# EasyEDA Pro project 10A_PWM_555.eprj

# Schematic 10A pwm jasmin
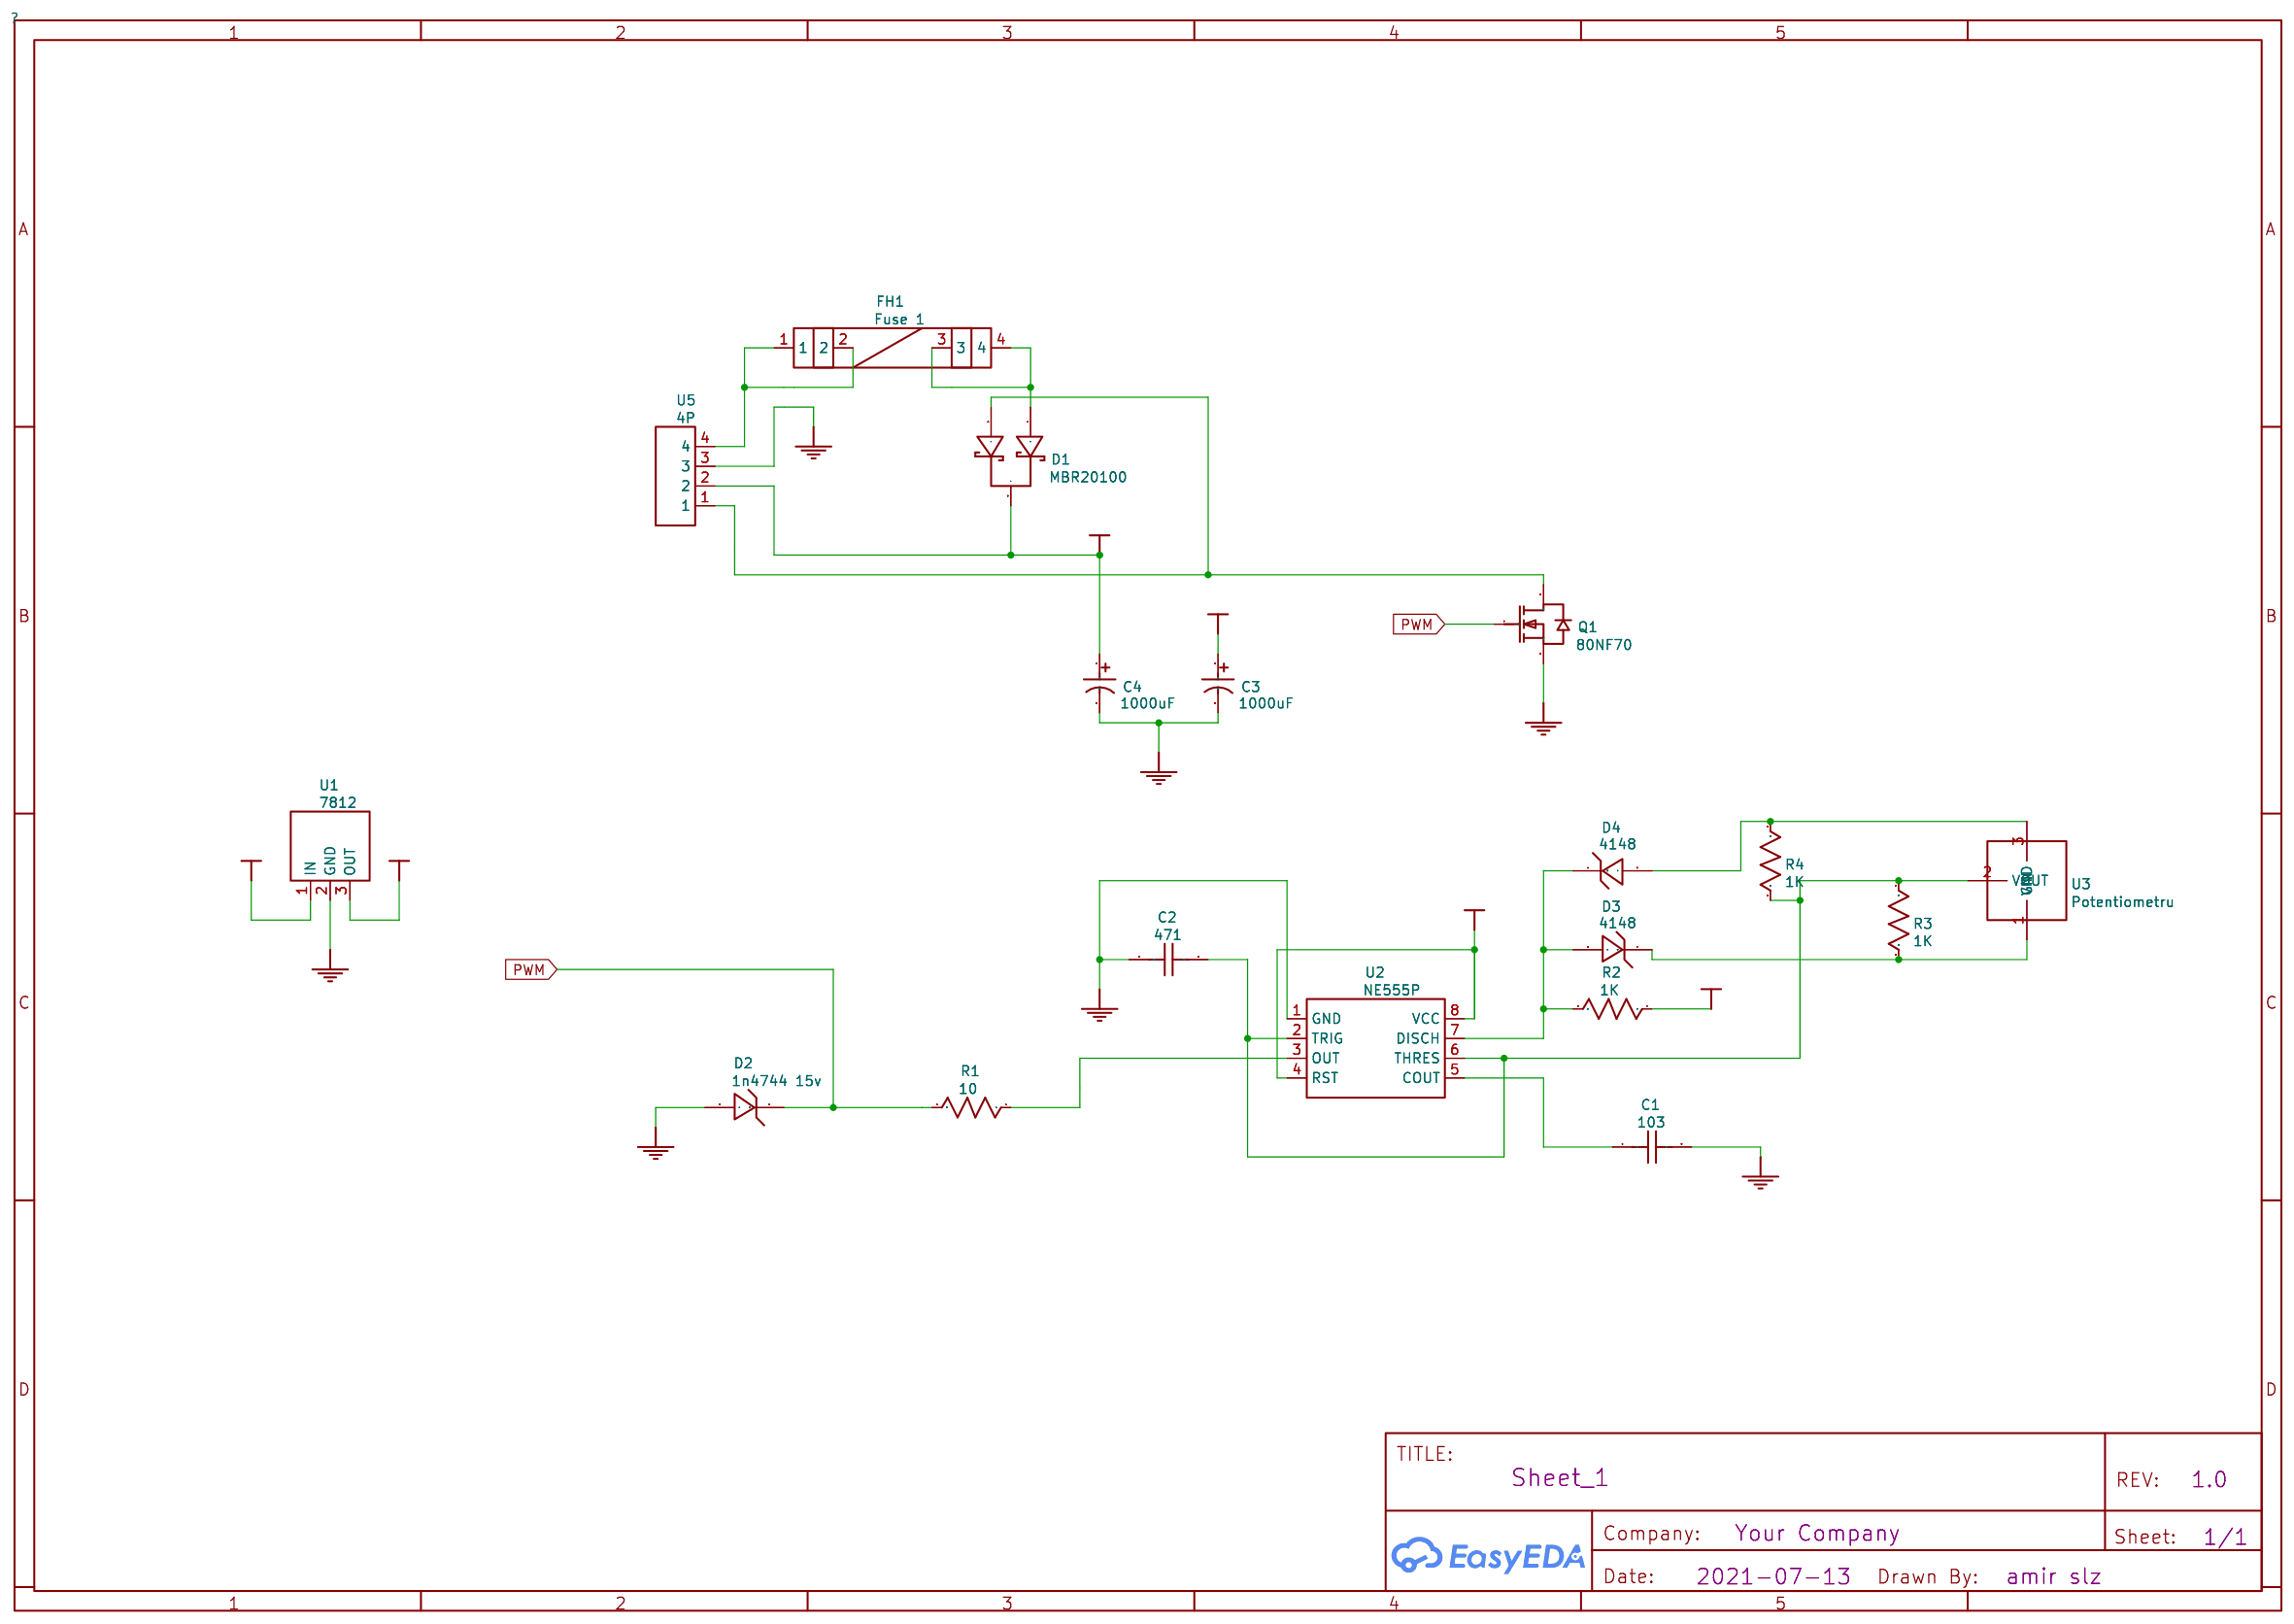
[diagram p0: schematic sheet]

## Parts
C1  103
C2  471
C3  1000uF  [CAP-TH_BD12.5-P5.00-D0.6-FD]
C4  1000uF  [CAP-TH_BD12.5-P5.00-D0.6-FD]
D1  MBR20100  [TO-220AB-3_L10.4-W4.6-P2.54-L]
D2  1n4744 15v  [DO-41_BD2.4-L4.7-P8.70-D0.9-RD]
D3  4148  [DO-41_BD2.4-L4.7-P8.70-D0.9-RD]
D4  4148  [DO-41_BD2.4-L4.7-P8.70-D0.9-RD]
FH1  Fuse 1
Q1  80NF70  [TO-220AB-3_L10.4-W4.6-P2.54-L]
R1  10
R2  1K
R3  1K
R4  1K
U1  7812  [TO-220-3_L10.0-W4.5-P2.54-L]
U2  NE555P  [DIP-8_L9.8-W6.6-P2.54-LS7.6-BL]
U3  Potentiometru
U5  4P

## Library data of the parts
C1 = 103: Supplier: LCSC; Supplier Part: C913493; Manufacturer: muRata(村田); Manufacturer Part: RDE5C1H100J0M1H03A; JLCPCB Part Class: Extended Part; Contributor: LCSC; spicePre: C; spiceSymbolName: RDE5C1H100J0M1H03A
C2 = 471: Supplier: LCSC; Supplier Part: C913493; Manufacturer: muRata(村田); Manufacturer Part: RDE5C1H100J0M1H03A; JLCPCB Part Class: Extended Part; Contributor: LCSC; spicePre: C; spiceSymbolName: RDE5C1H100J0M1H03A
C3 C4 = 1000uF: Supplier: LCSC; Manufacturer: ValuePro; Manufacturer Part: 1000uF 50V; Supplier Part: C18104; JLCPCB Part Class: Extended Part; nameAlias: Capacitance; spicePre: C; spiceSymbolName: 1000uF 50V
D1 = MBR20100: Supplier: LCSC; Supplier Part: C432693; Manufacturer: Chongqing Pingwei Tech; Manufacturer Part: MBR20150LCT; JLCPCB Part Class: Extended Part; Contributor: LCSC; spicePre: D; spiceSymbolName: MBR20150LCT
D2 = 1n4744 15v: Supplier: LCSC; Supplier Part: C232465; Manufacturer: ON Semicon; Manufacturer Part: 1N5919BRLG; JLCPCB Part Class: Extended Part; Contributor: LCSC; spicePre: D; spiceSymbolName: 1N5919BRLG
D3 D4 = 4148: Supplier: LCSC; Supplier Part: C232465; Manufacturer: ON Semicon; Manufacturer Part: 1N5919BRLG; JLCPCB Part Class: Extended Part; Contributor: LCSC; spicePre: D; spiceSymbolName: 1N5919BRLG
FH1 = Fuse 1: Supplier Part: C377342; Manufacturer: HOLLY(好利来); Manufacturer Part: HF-004/J; JLCPCB Part Class: Extended Part; Contributor: amir slz; spicePre: F
Q1 = 80NF70: Supplier: LCSC; Supplier Part: C469330; Manufacturer: VISHAY(威世); Manufacturer Part: IRF540PBF; JLCPCB Part Class: Extended Part; Contributor: LCSC; spicePre: Q; spiceSymbolName: IRF540PBF
R1 = 10: Manufacturer Part: 0.4W 1% RESISTOR; Contributor: dannyjacket; spicePre: U; spiceSymbolName: RESISTOR
R2-R4 = 1K: Manufacturer Part: 0.4W 1% RESISTOR; Contributor: dannyjacket; spicePre: U; spiceSymbolName: RESISTOR
U1 = 7812: Supplier: LCSC; Supplier Part: C358369; Manufacturer: Foshan Blue Rocket Elec; JLCPCB Part Class: Extended Part; Contributor: LCSC; spicePre: U
U2 = NE555P: Supplier: LCSC; Manufacturer: TI; Supplier Part: C46749; JLCPCB Part Class: Extended Part; spicePre: U
U3 = Potentiometru: Contributor: DMCalin; spicePre: U
U5 = 4P: Supplier: LCSC; Supplier Part: C729813; Manufacturer: DIBO; Manufacturer Part: DBT50B-9.5-4P; JLCPCB Part Class: Extended Part; Contributor: LCSC; spicePre: U; spiceSymbolName: DBT50B-9.5-4P

## Nets
+12V: C3.1 R2.1 U1.3(OUT) U2.4(RST) U2.8(VCC)
GND: C1.2 C2.1 C3.2 C4.2 D2.2(A) Q1.3(S) U1.2(GND) U2.1(GND) U5.3
VCC: C4.1 D1.2(-) U1.1(IN) U5.2
PWM: D2.1(C) Q1.1(G) R1.2
D1_1: D1.1(+) FH1.3 FH1.4
D1_3: D1.3(+) Q1.2(D) U5.1
D3_1: D3.1(C) R3.2 U3.1(VIN)
D4_2: D4.2(A) R4.2 U3.3(GND)
U2_2: C2.2 R3.1 R4.1 U2.2(TRIG) U2.6(THRES) U3.2(VOUT)
U2_3: R1.1 U2.3(OUT)
U2_5: C1.1 U2.5(COUT)
U2_7: D3.2(A) D4.1(C) R2.2 U2.7(DISCH)
U5_4: FH1.1 FH1.2 U5.4

# Board PCB_10A-pwm-DIP_2026-05-13
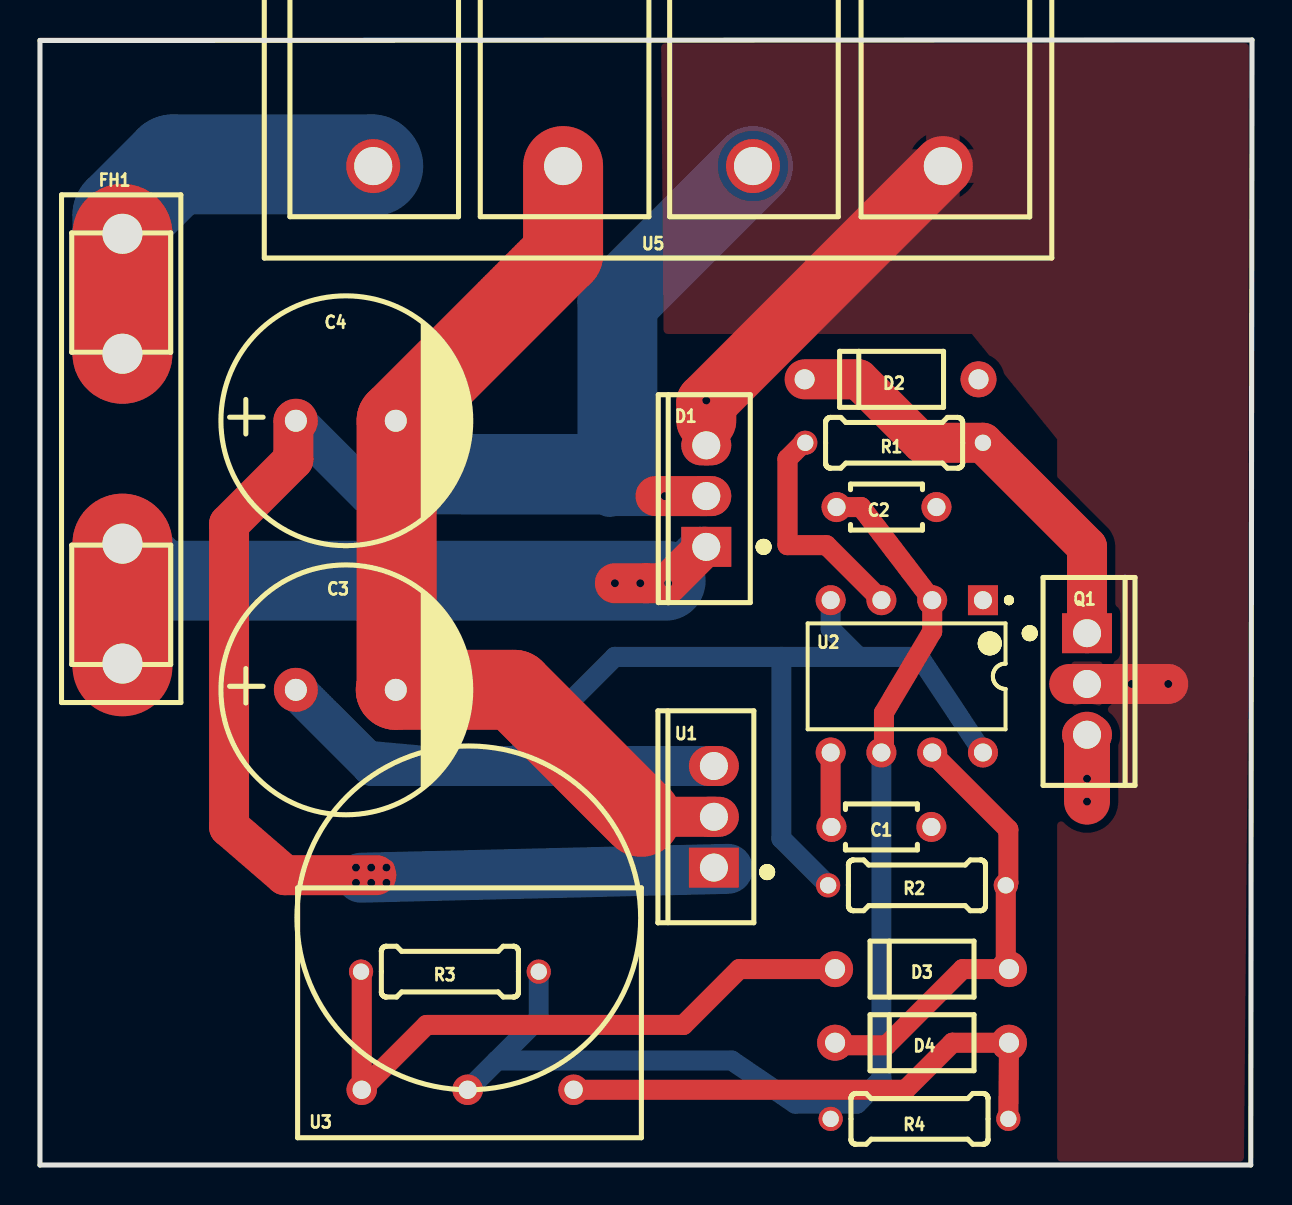
[diagram p1: board, top side]
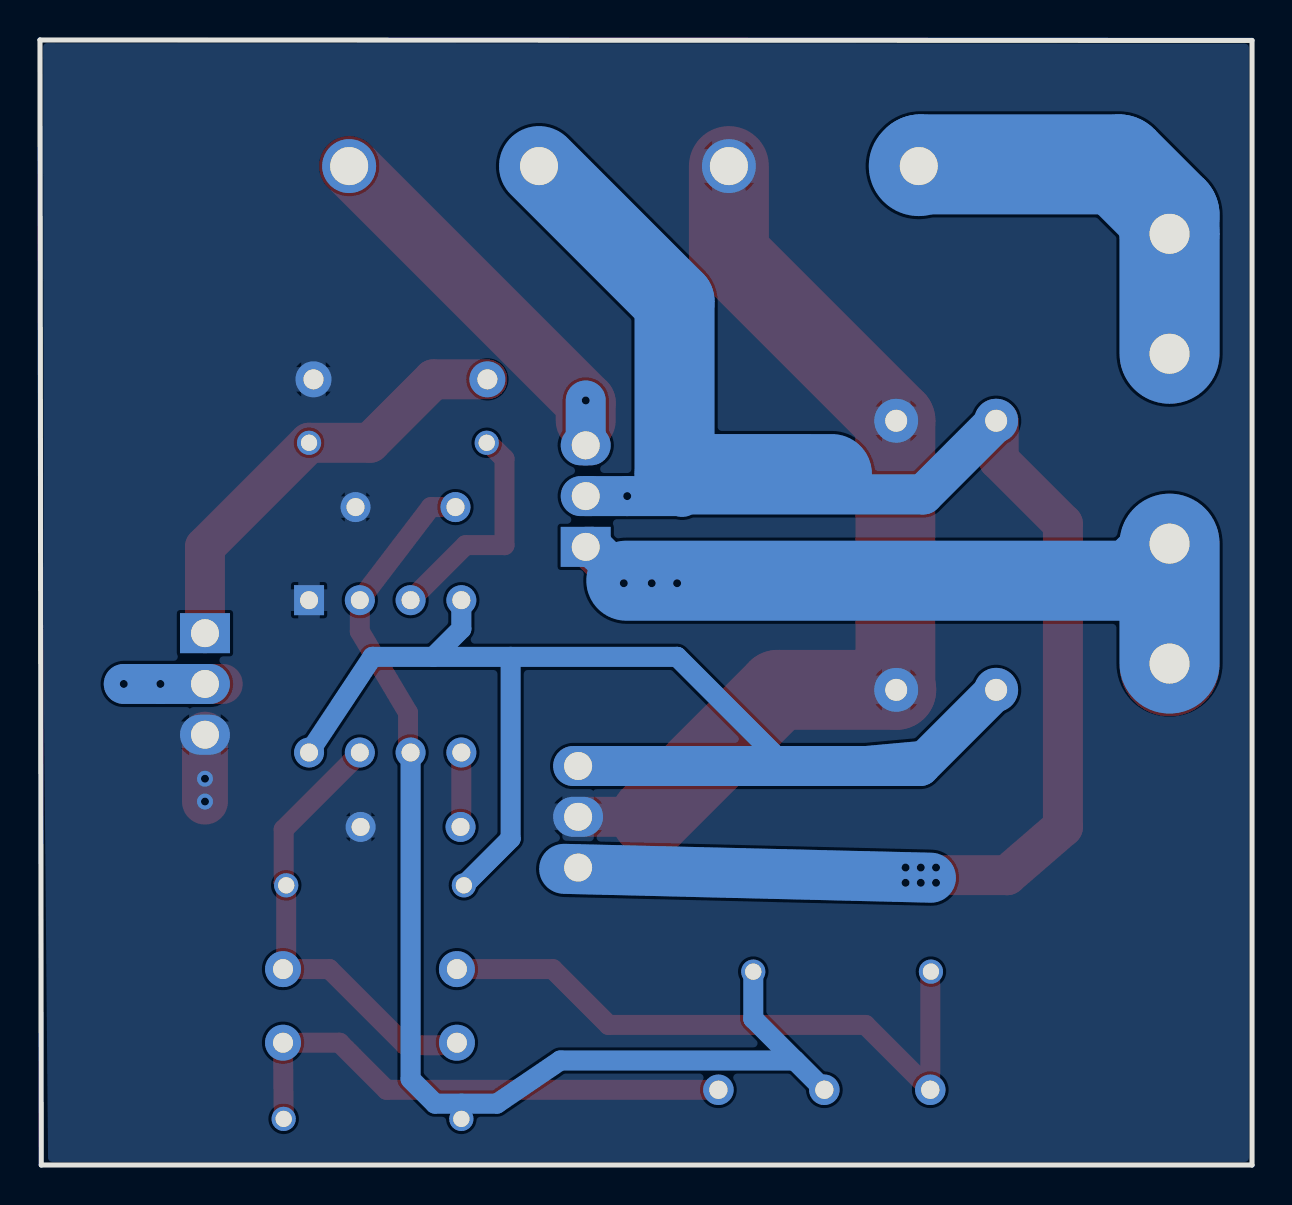
[diagram p2: board, bottom side, seen from below]

Outline 60.64 x 56.28 mm; copper layers: Top Layer, Bottom Layer. Coordinates in mm from the lower left corner of the outline.
Outline path: 0,56.26 60.64,56.28 60.58,0 0,0 0,56.26
Stack: Top Layer 0.035mm / Dielectric1 1.51mm FR4 er 4.5 / Bottom Layer 0.035mm

## Design rules (mm)
spacing Default (default): track to track 0.152, other pairs 0 to 0.152
track width Default (default): min 0.254, default 0.254, max 25.4
differential pair differentialPair (default): width min 0.127, default 0.254, max 2.54; gap min 0.152, default 0.152
via Default (default): diameter min 0.61, default 0.61, max 100.025; hole min 0.305, default 0.305, max 59.995
pour e67 uses gge2414
pour e113 uses gge2398

## Placement (name value [footprint] x y rotation side)
C1  103  [CAP-TH_L3.6-W2.3-P5.00-D0.5]  42.1 16.91 0 top
C2  471  [CAP-TH_L3.6-W2.3-P5.00-D0.5]  42.35 32.92 180 top
C3  1000uF  [CAP-TH_BD12.5-P5.00-D0.6-FD]  15.3 23.77 0 top
C4  1000uF  [CAP-TH_BD12.5-P5.00-D0.6-FD]  15.3 37.23 0 top
D1  MBR20100  [TO-220AB-3_L10.4-W4.6-P2.54-L]  33.34 33.46 90 top
D2  1n4744 15v  [DO-41_BD2.4-L4.7-P8.70-D0.9-RD]  42.61 39.31 0 top
D3  4148  [DO-41_BD2.4-L4.7-P8.70-D0.9-RD]  44.13 9.8 0 top
D4  4148  [DO-41_BD2.4-L4.7-P8.70-D0.9-RD]  44.13 6.12 0 top
FH1  Fuse 1  [FUSE]  4.13 35.84 270 top
Q1  80NF70  [TO-220AB-3_L10.4-W4.6-P2.54-L]  52.39 24.07 270 top
R1  10  [0.4W 1% RESISTOR]  47.18 36.13 180 top
R2  1K  [0.4W 1% RESISTOR]  48.32 13.99 180 top
R3  1K  [0.4W 1% RESISTOR]  16.07 9.67 0 top
R4  1K  [0.4W 1% RESISTOR]  48.45 2.31 180 top
U1  7812  [TO-220-3_L10.0-W4.5-P2.54-L]  33.72 17.42 90 top
U2  NE555P  [DIP-8_L9.8-W6.6-P2.54-LS7.6-BL]  43.37 24.45 180 top
U3  Potentiometru  [POTENTIOMETRU]  21.4 5.86 90 top
U5  4P  [CONN-TH_DBT50B-9.5-4P]  30.92 49.97 180 top

## Footprints (pads in the part's own frame, mm; a bottom-side part is the same pattern mirrored in y, then rotated)
0.4W 1% RESISTOR
  round 1.212 hole 0.813: 1(8.89,0) 2(0,0)
CAP-TH_BD12.5-P5.00-D0.6-FD
  round 2.2 hole 1.1: 1(-2.5,0) 2(2.5,0)
CAP-TH_L3.6-W2.3-P5.00-D0.5
  round 1.5 hole 0.9: 1(-2.5,0) 2(2.5,0)
CONN-TH_DBT50B-9.5-4P
  round 2.7 hole 1.9: 1(-14.25,0) 2(-4.75,0) 3(4.75,0) 4(14.25,0)
DIP-8_L9.8-W6.6-P2.54-LS7.6-BL
  rect 1.5x1.5 hole 0.9: 1(-3.81,-3.81)
  round 1.5 hole 0.9: 2(-1.27,-3.81) 3(1.27,-3.81) 4(3.81,-3.81) 5(3.81,3.81) 6(1.27,3.81) 7(-1.27,3.81) 8(-3.81,3.81)
DO-41_BD2.4-L4.7-P8.70-D0.9-RD
  round 1.8 hole 1: 1(-4.35,0) 2(4.35,0)
FUSE
  round 3 hole 2: 1(-10.75,0) 2(-4.75,0) 3(4.75,0) 4(10.75,0)
POTENTIOMETRU
  round 1.524 hole 0.914: 1(-2.1,5.3) 2(-2.1,0) 3(-2.1,-5.3)
TO-220-3_L10.0-W4.5-P2.54-L
  rect 2x2.5 hole 1.4: 1(-2.54,0)
  oval 2x2.5 hole 1.4: 2(0,0) 3(2.54,0)
TO-220AB-3_L10.4-W4.6-P2.54-L
  rect 2x2.5 hole 1.4: 1(-2.54,0)
  oval 2x2.5 hole 1.4: 2(0,0) 3(2.54,0)

## Nets
As in the schematic.

## Via types
v1: diameter 0.8, hole 0.4, Top Layer to Bottom Layer, 15 vias

## Routing (per net, layer and track width the routed paths; a pad name or vN(x,y) marks a point on that pad's centre or on a via; arc(x,y) is an arc through that point)
+12V: length 78.6
  Bottom Layer w1: 12.8,23.77 16.45,20.72 23.43,20.09 28.77,25.42 40.96,25.42 ; 40.96,25.42 44.01,25.42 U2.8 ; 40.96,25.42 39.56,26.82 U2.4 ; R2.1 37.09,16.33 37.09,25.42
  Bottom Layer w2: C3.1 16.61,19.96 U1.3
GND: length 52.2
  Top Layer w2: U1.2 30.08,17.42 29.65,17.84
  Top Layer w2.3: Q1.3 v1(52.39,18.18)
  Top Layer w4: U5.3 26.17,45.57 17.84,37.23 17.84,23.81 C3.2 23.73,23.77 30.08,17.42
  vias: v1(52.39,19.33)
VCC: length 99
  Top Layer w2: 16.83,14.5 12.26,14.5 9.46,16.91 9.46,32.07 12.68,35.29 12.68,37.23 ; D1.2 30.8,33.46
  Bottom Layer w2: C4.1 12.8,37.19 16.45,33.55 28.51,33.55 ; D1.2 v1(31.26,33.46) 28.55,33.46 28.51,33.42
  Bottom Layer w2.5: 34.42,14.82 16.07,14.37
  Bottom Layer w4: 21.02,34.57 28.89,34.57 28.89,43.19 U5.2
  vias: v1(15.81,14.88) v1(15.81,14.12) v1(16.57,14.88) v1(16.57,14.12) v1(17.34,14.88) v1(17.34,14.12)
D1_1: length 48.1
  Top Layer w2: D1.1 33.25,30.92 v1(31.43,29.11) v1(28.77,29.11)
  Top Layer w5: FH1.3 4.13,24.95
  Bottom Layer w2: 31.31,29.23 33,30.92 D1.1
  Bottom Layer w4: FH1.3 5.98,29.23 31.31,29.23
  Bottom Layer w5: FH1.4 FH1.3
  vias: v1(30.04,29.11)
D1_3: length 31
  Top Layer w2: D1.3 33.34,38.14 ; v1(56.45,24.07) v1(54.62,24.07) 51.5,24.07
  Top Layer w3: U5.1 33.34,38.14 33.34,37.23
  Bottom Layer w2: Q1.2 v1(54.62,24.07) v1(56.45,24.07) ; D1.3 v1(33.34,38.25)
D3_1: length 32.1
  Top Layer w1: D3.1 34.99,9.8 32.19,7.01 19.34,7.01 U3.1 16.1,9.64 R3.2
D4_2: length 26.6
  Top Layer w1: 26.7,3.76 43.3,3.76 45.66,6.12 D4.2 R4.2
PWM: length 21.9
  Top Layer w2: D2.1 40.96,39.31 44.13,36.13 R1.2 52.39,30.92 Q1.1
U2_2: length 62.3
  Top Layer w1: U2.6 42.23,20.76 42.23,22.63 44.64,26.69 U2.2 41.08,32.92 39.86,32.92
  Bottom Layer w1: R3.1 24.96,7.32 U3.2 22.86,5.23 34.61,5.23 37.78,3.07 40.88,3.07 42.1,4.3 ; U2.6 42.1,4.34 ; R4.1 39.56,3.07
U2_3: length 11.4
  Top Layer w1: U2.3 39.35,31.01 37.4,31.01 37.4,35.33 38.2,36.13 R1.1
U2_5: length 3.7
  Top Layer w1: C1.1 39.56,16.95 U2.5
U2_7: length 22.9
  Top Layer w1: D4.1 39.91,5.99 42.35,5.99 46.16,9.8 D3.2 48.32,9.96 R2.2 48.45,14.12 48.45,16.79 44.64,20.6 U2.7
U5_4: length 26.6
  Top Layer w5: FH1.1 FH1.2
  Bottom Layer w5: FH1.2 FH1.1 4.13,47.52 6.67,50.06 16.59,50.06 U5.4

## Copper pours and planes (outline as drawn; the poured copper is in the pictures)
GND on Bottom Layer: -0.06,56.28 60.64,56.16 60.13,0.15 60.39,-0.1 0.06,0.02
D1_3 on Top Layer: 50.99,0.28 60.13,0.28 60.64,56.16 31.31,56.03 31.18,56.16 31.31,41.68 46.67,41.68 50.99,36.34
